# Altium schematic sheet DDR4_Arria10.SchDoc: DDR4
size B; DocumentNumber: 19; SheetNumber: 19; SheetTotal: 46
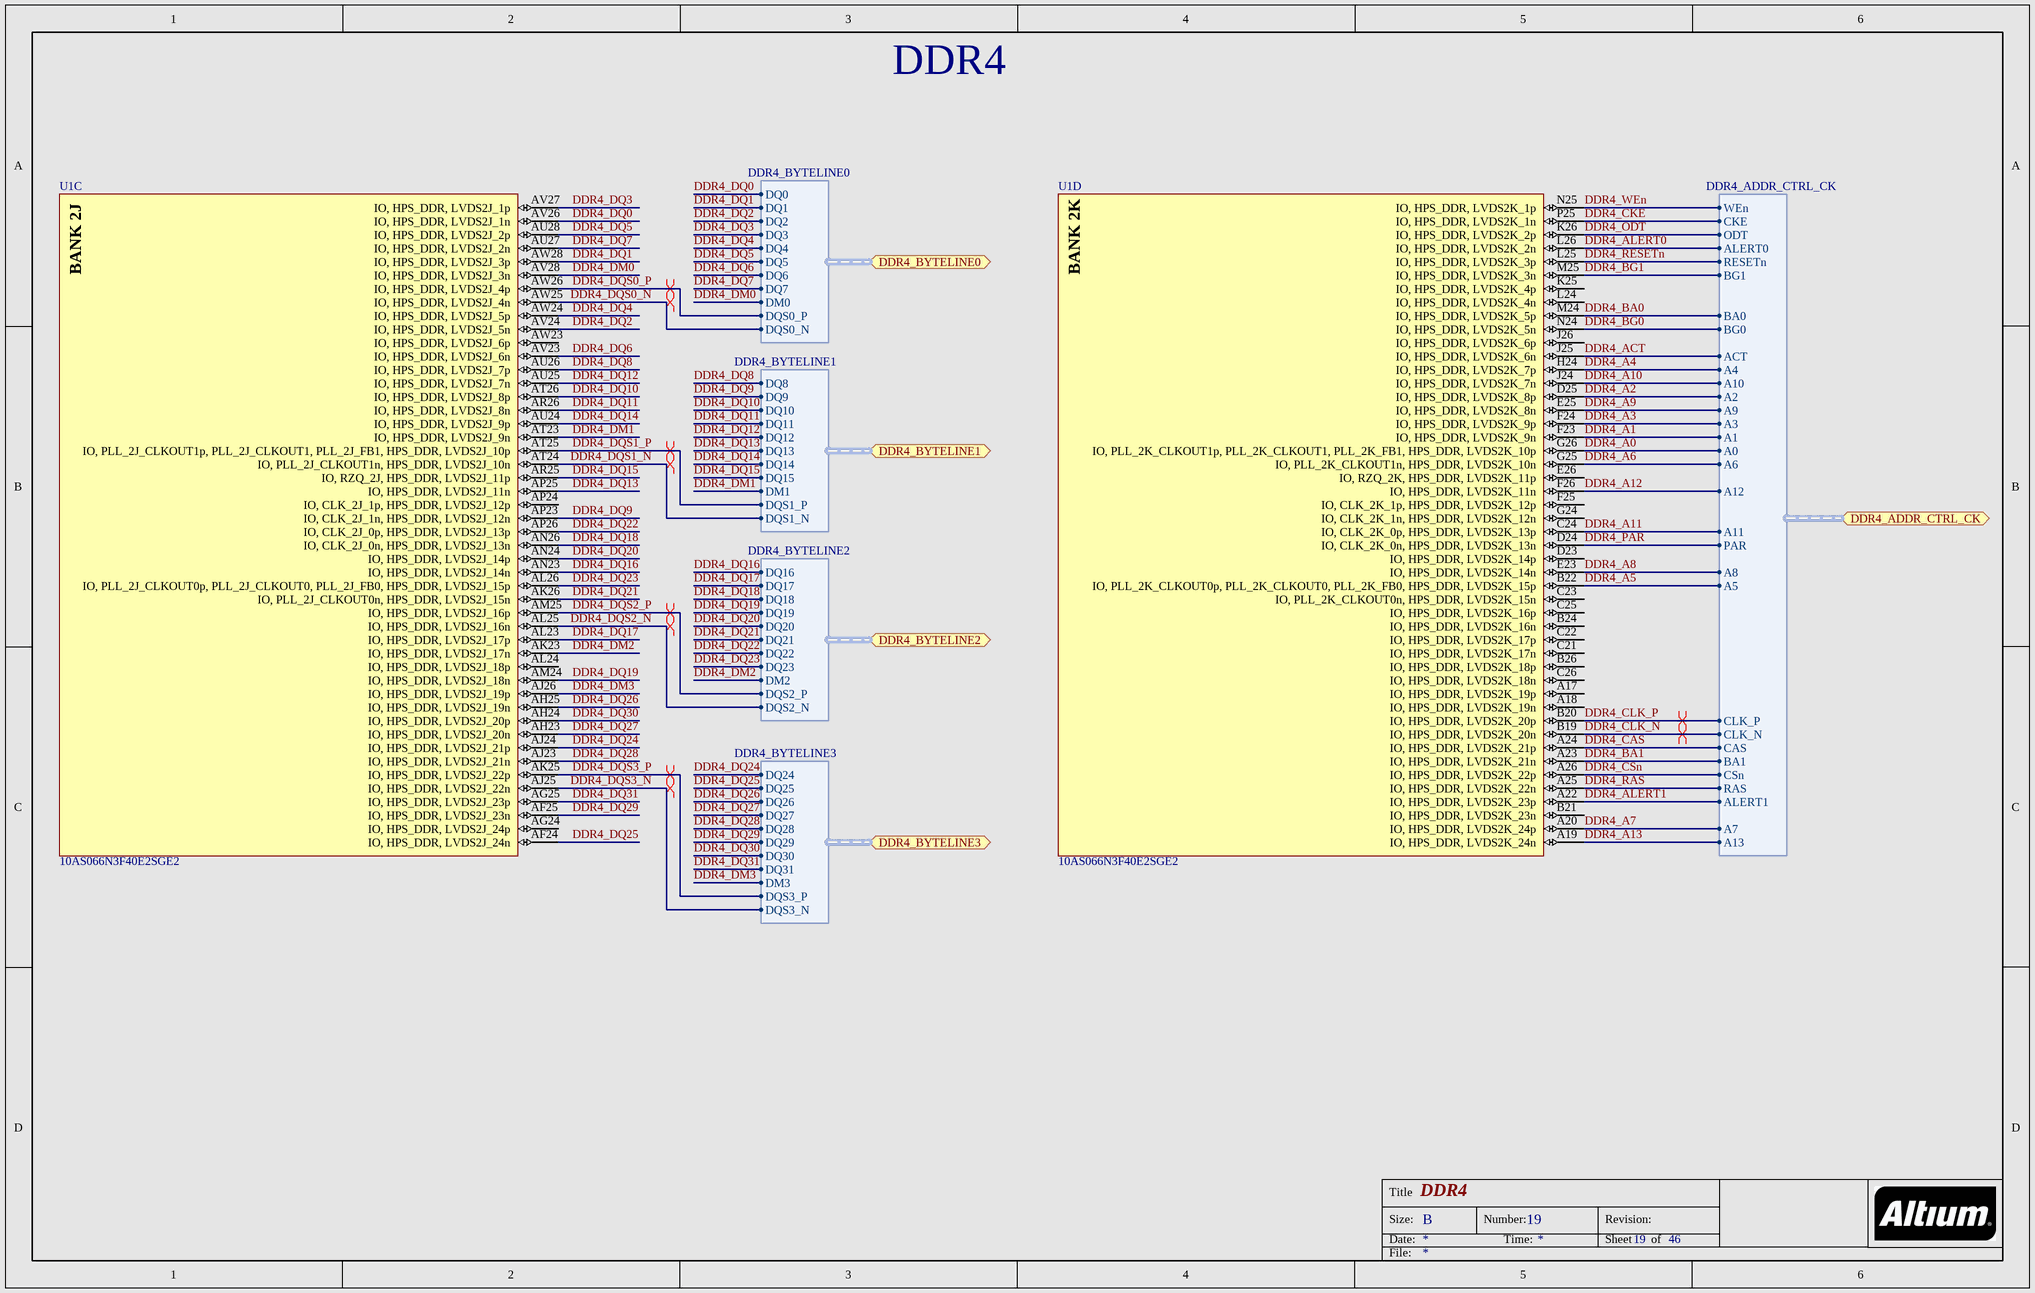
[diagram p0: DDR4_Arria10.SchDoc]

## Parts
U1  10AS066N3F40E2SGE2  [ALTR-FBGA1517_A-350]  (parts C,D of 31)

## Ports
DDR4_ADDR_CTRL_CK (harness DDR4_ADDR_CTRL_CK), DDR4_BYTELINE0 (harness DDR4_BYTELINE0), DDR4_BYTELINE1 (harness DDR4_BYTELINE1), DDR4_BYTELINE2 (harness DDR4_BYTELINE2), DDR4_BYTELINE3 (harness DDR4_BYTELINE3)

## Harnesses
DDR4_BYTELINE0: DQ0, DQ1, DQ2, DQ3, DQ4, DQ5, DQ6, DQ7, DM0, DQS0_P, DQS0_N
DDR4_BYTELINE1: DQ8, DQ9, DQ10, DQ11, DQ12, DQ13, DQ14, DQ15, DM1, DQS1_P, DQS1_N
DDR4_BYTELINE2: DQ16, DQ17, DQ18, DQ19, DQ20, DQ21, DQ22, DQ23, DM2, DQS2_P, DQS2_N
DDR4_BYTELINE3: DQ24, DQ25, DQ26, DQ27, DQ28, DQ29, DQ30, DQ31, DM3, DQS3_P, DQS3_N
DDR4_ADDR_CTRL_CK: A0, A1, A2, A3, A4, A5, A6, A7, A8, A9, A10, A11, A12, A13, BA0, BA1, BG0, CLK_P, CLK_N, CKE, WEn, CAS, RAS, CSn, PAR, ACT, ODT, ALERT0, RESETn, BG1, ALERT1

## Nets
DDR4_A0: U1.G26(IO,_PLL_2K_CLKOUT1p,_PLL_2K_CLKOUT1,_PLL_2K_FB1,_HPS_DDR,_LVDS2K_10p) ; port DDR4_ADDR_CTRL_CK.A0
DDR4_A1: U1.F23(IO,_HPS_DDR,_LVDS2K_9n) ; port DDR4_ADDR_CTRL_CK.A1
DDR4_A2: U1.D25(IO,_HPS_DDR,_LVDS2K_8p) ; port DDR4_ADDR_CTRL_CK.A2
DDR4_A3: U1.F24(IO,_HPS_DDR,_LVDS2K_9p) ; port DDR4_ADDR_CTRL_CK.A3
DDR4_A4: U1.H24(IO,_HPS_DDR,_LVDS2K_7p) ; port DDR4_ADDR_CTRL_CK.A4
DDR4_A5: U1.B22(IO,_PLL_2K_CLKOUT0p,_PLL_2K_CLKOUT0,_PLL_2K_FB0,_HPS_DDR,_LVDS2K_15p) ; port DDR4_ADDR_CTRL_CK.A5
DDR4_A6: U1.G25(IO,_PLL_2K_CLKOUT1n,_HPS_DDR,_LVDS2K_10n) ; port DDR4_ADDR_CTRL_CK.A6
DDR4_A7: U1.A20(IO,_HPS_DDR,_LVDS2K_24p) ; port DDR4_ADDR_CTRL_CK.A7
DDR4_A8: U1.E23(IO,_HPS_DDR,_LVDS2K_14n) ; port DDR4_ADDR_CTRL_CK.A8
DDR4_A9: U1.E25(IO,_HPS_DDR,_LVDS2K_8n) ; port DDR4_ADDR_CTRL_CK.A9
DDR4_A10: U1.J24(IO,_HPS_DDR,_LVDS2K_7n) ; port DDR4_ADDR_CTRL_CK.A10
DDR4_A11: U1.C24(IO,_CLK_2K_0p,_HPS_DDR,_LVDS2K_13p) ; port DDR4_ADDR_CTRL_CK.A11
DDR4_A12: U1.F26(IO,_HPS_DDR,_LVDS2K_11n) ; port DDR4_ADDR_CTRL_CK.A12
DDR4_A13: U1.A19(IO,_HPS_DDR,_LVDS2K_24n) ; port DDR4_ADDR_CTRL_CK.A13
DDR4_ACT: U1.J25(IO,_HPS_DDR,_LVDS2K_6n) ; port DDR4_ADDR_CTRL_CK.ACT
DDR4_ALERT0: U1.L26(IO,_HPS_DDR,_LVDS2K_2n) ; port DDR4_ADDR_CTRL_CK.ALERT0
DDR4_ALERT1: U1.A22(IO,_HPS_DDR,_LVDS2K_23p) ; port DDR4_ADDR_CTRL_CK.ALERT1
DDR4_BA0: U1.M24(IO,_HPS_DDR,_LVDS2K_5p) ; port DDR4_ADDR_CTRL_CK.BA0
DDR4_BA1: U1.A23(IO,_HPS_DDR,_LVDS2K_21n) ; port DDR4_ADDR_CTRL_CK.BA1
DDR4_BG0: U1.N24(IO,_HPS_DDR,_LVDS2K_5n) ; port DDR4_ADDR_CTRL_CK.BG0
DDR4_BG1: U1.M25(IO,_HPS_DDR,_LVDS2K_3n) ; port DDR4_ADDR_CTRL_CK.BG1
DDR4_CAS: U1.A24(IO,_HPS_DDR,_LVDS2K_21p) ; port DDR4_ADDR_CTRL_CK.CAS
DDR4_CKE: U1.P25(IO,_HPS_DDR,_LVDS2K_1n) ; port DDR4_ADDR_CTRL_CK.CKE
DDR4_CLK_N: U1.B19(IO,_HPS_DDR,_LVDS2K_20n) ; port DDR4_ADDR_CTRL_CK.CLK_N
DDR4_CLK_P: U1.B20(IO,_HPS_DDR,_LVDS2K_20p) ; port DDR4_ADDR_CTRL_CK.CLK_P
DDR4_CSn: U1.A26(IO,_HPS_DDR,_LVDS2K_22p) ; port DDR4_ADDR_CTRL_CK.CSn
DDR4_DM0: U1.AV28(IO,_HPS_DDR,_LVDS2J_3n) ; port DDR4_BYTELINE0.DM0
DDR4_DM1: U1.AT23(IO,_HPS_DDR,_LVDS2J_9n) ; port DDR4_BYTELINE1.DM1
DDR4_DM2: U1.AK23(IO,_HPS_DDR,_LVDS2J_17n) ; port DDR4_BYTELINE2.DM2
DDR4_DM3: U1.AJ26(IO,_HPS_DDR,_LVDS2J_19p) ; port DDR4_BYTELINE3.DM3
DDR4_DQ0: U1.AV26(IO,_HPS_DDR,_LVDS2J_1n) ; port DDR4_BYTELINE0.DQ0
DDR4_DQ1: U1.AW28(IO,_HPS_DDR,_LVDS2J_3p) ; port DDR4_BYTELINE0.DQ1
DDR4_DQ2: U1.AV24(IO,_HPS_DDR,_LVDS2J_5n) ; port DDR4_BYTELINE0.DQ2
DDR4_DQ3: U1.AV27(IO,_HPS_DDR,_LVDS2J_1p) ; port DDR4_BYTELINE0.DQ3
DDR4_DQ4: U1.AW24(IO,_HPS_DDR,_LVDS2J_5p) ; port DDR4_BYTELINE0.DQ4
DDR4_DQ5: U1.AU28(IO,_HPS_DDR,_LVDS2J_2p) ; port DDR4_BYTELINE0.DQ5
DDR4_DQ6: U1.AV23(IO,_HPS_DDR,_LVDS2J_6n) ; port DDR4_BYTELINE0.DQ6
DDR4_DQ7: U1.AU27(IO,_HPS_DDR,_LVDS2J_2n) ; port DDR4_BYTELINE0.DQ7
DDR4_DQ8: U1.AU26(IO,_HPS_DDR,_LVDS2J_7p) ; port DDR4_BYTELINE1.DQ8
DDR4_DQ9: U1.AP23(IO,_CLK_2J_1n,_HPS_DDR,_LVDS2J_12n) ; port DDR4_BYTELINE1.DQ9
DDR4_DQ10: U1.AT26(IO,_HPS_DDR,_LVDS2J_8p) ; port DDR4_BYTELINE1.DQ10
DDR4_DQ11: U1.AR26(IO,_HPS_DDR,_LVDS2J_8n) ; port DDR4_BYTELINE1.DQ11
DDR4_DQ12: U1.AU25(IO,_HPS_DDR,_LVDS2J_7n) ; port DDR4_BYTELINE1.DQ12
DDR4_DQ13: U1.AP25(IO,_HPS_DDR,_LVDS2J_11n) ; port DDR4_BYTELINE1.DQ13
DDR4_DQ14: U1.AU24(IO,_HPS_DDR,_LVDS2J_9p) ; port DDR4_BYTELINE1.DQ14
DDR4_DQ15: U1.AR25(IO,_RZQ_2J,_HPS_DDR,_LVDS2J_11p) ; port DDR4_BYTELINE1.DQ15
DDR4_DQ16: U1.AN23(IO,_HPS_DDR,_LVDS2J_14n) ; port DDR4_BYTELINE2.DQ16
DDR4_DQ17: U1.AL23(IO,_HPS_DDR,_LVDS2J_17p) ; port DDR4_BYTELINE2.DQ17
DDR4_DQ18: U1.AN26(IO,_CLK_2J_0n,_HPS_DDR,_LVDS2J_13n) ; port DDR4_BYTELINE2.DQ18
DDR4_DQ19: U1.AM24(IO,_HPS_DDR,_LVDS2J_18n) ; port DDR4_BYTELINE2.DQ19
DDR4_DQ20: U1.AN24(IO,_HPS_DDR,_LVDS2J_14p) ; port DDR4_BYTELINE2.DQ20
DDR4_DQ21: U1.AK26(IO,_PLL_2J_CLKOUT0n,_HPS_DDR,_LVDS2J_15n) ; port DDR4_BYTELINE2.DQ21
DDR4_DQ22: U1.AP26(IO,_CLK_2J_0p,_HPS_DDR,_LVDS2J_13p) ; port DDR4_BYTELINE2.DQ22
DDR4_DQ23: U1.AL26(IO,_PLL_2J_CLKOUT0p,_PLL_2J_CLKOUT0,_PLL_2J_FB0,_HPS_DDR,_LVDS2J_15p) ; port DDR4_BYTELINE2.DQ23
DDR4_DQ24: U1.AJ24(IO,_HPS_DDR,_LVDS2J_21p) ; port DDR4_BYTELINE3.DQ24
DDR4_DQ25: U1.AF24(IO,_HPS_DDR,_LVDS2J_24n) ; port DDR4_BYTELINE3.DQ25
DDR4_DQ26: U1.AH25(IO,_HPS_DDR,_LVDS2J_19n) ; port DDR4_BYTELINE3.DQ26
DDR4_DQ27: U1.AH23(IO,_HPS_DDR,_LVDS2J_20n) ; port DDR4_BYTELINE3.DQ27
DDR4_DQ28: U1.AJ23(IO,_HPS_DDR,_LVDS2J_21n) ; port DDR4_BYTELINE3.DQ28
DDR4_DQ29: U1.AF25(IO,_HPS_DDR,_LVDS2J_23n) ; port DDR4_BYTELINE3.DQ29
DDR4_DQ30: U1.AH24(IO,_HPS_DDR,_LVDS2J_20p) ; port DDR4_BYTELINE3.DQ30
DDR4_DQ31: U1.AG25(IO,_HPS_DDR,_LVDS2J_23p) ; port DDR4_BYTELINE3.DQ31
DDR4_DQS0_N: U1.AW25(IO,_HPS_DDR,_LVDS2J_4n) ; port DDR4_BYTELINE0.DQS0_N
DDR4_DQS0_P: U1.AW26(IO,_HPS_DDR,_LVDS2J_4p) ; port DDR4_BYTELINE0.DQS0_P
DDR4_DQS1_N: U1.AT24(IO,_PLL_2J_CLKOUT1n,_HPS_DDR,_LVDS2J_10n) ; port DDR4_BYTELINE1.DQS1_N
DDR4_DQS1_P: U1.AT25(IO,_PLL_2J_CLKOUT1p,_PLL_2J_CLKOUT1,_PLL_2J_FB1,_HPS_DDR,_LVDS2J_10p) ; port DDR4_BYTELINE1.DQS1_P
DDR4_DQS2_N: U1.AL25(IO,_HPS_DDR,_LVDS2J_16n) ; port DDR4_BYTELINE2.DQS2_N
DDR4_DQS2_P: U1.AM25(IO,_HPS_DDR,_LVDS2J_16p) ; port DDR4_BYTELINE2.DQS2_P
DDR4_DQS3_N: U1.AJ25(IO,_HPS_DDR,_LVDS2J_22n) ; port DDR4_BYTELINE3.DQS3_N
DDR4_DQS3_P: U1.AK25(IO,_HPS_DDR,_LVDS2J_22p) ; port DDR4_BYTELINE3.DQS3_P
DDR4_ODT: U1.K26(IO,_HPS_DDR,_LVDS2K_2p) ; port DDR4_ADDR_CTRL_CK.ODT
DDR4_PAR: U1.D24(IO,_CLK_2K_0n,_HPS_DDR,_LVDS2K_13n) ; port DDR4_ADDR_CTRL_CK.PAR
DDR4_RAS: U1.A25(IO,_HPS_DDR,_LVDS2K_22n) ; port DDR4_ADDR_CTRL_CK.RAS
DDR4_RESETn: U1.L25(IO,_HPS_DDR,_LVDS2K_3p) ; port DDR4_ADDR_CTRL_CK.RESETn
DDR4_WEn: U1.N25(IO,_HPS_DDR,_LVDS2K_1p) ; port DDR4_ADDR_CTRL_CK.WEn

Not connected (* = marked no-connect by the designer): U1 A17(IO,_HPS_DDR,_LVDS2K_19p) A18(IO,_HPS_DDR,_LVDS2K_19n) AG24(IO,_HPS_DDR,_LVDS2J_24p) AL24(IO,_HPS_DDR,_LVDS2J_18p) AP24(IO,_CLK_2J_1p,_HPS_DDR,_LVDS2J_12p) AW23(IO,_HPS_DDR,_LVDS2J_6p) B21(IO,_HPS_DDR,_LVDS2K_23n) B24(IO,_HPS_DDR,_LVDS2K_16n) B26(IO,_HPS_DDR,_LVDS2K_18p) C21(IO,_HPS_DDR,_LVDS2K_17n) C22(IO,_HPS_DDR,_LVDS2K_17p) C23(IO,_PLL_2K_CLKOUT0n,_HPS_DDR,_LVDS2K_15n) C25(IO,_HPS_DDR,_LVDS2K_16p) C26(IO,_HPS_DDR,_LVDS2K_18n) D23(IO,_HPS_DDR,_LVDS2K_14p) E26(IO,_RZQ_2K,_HPS_DDR,_LVDS2K_11p) F25(IO,_CLK_2K_1p,_HPS_DDR,_LVDS2K_12p) G24(IO,_CLK_2K_1n,_HPS_DDR,_LVDS2K_12n) J26(IO,_HPS_DDR,_LVDS2K_6p) K25(IO,_HPS_DDR,_LVDS2K_4p) L24(IO,_HPS_DDR,_LVDS2K_4n)

## Layout directives
differential pair: DDR4_CLK_N, DDR4_CLK_P, DDR4_DQS0_N, DDR4_DQS0_P, DDR4_DQS1_N, DDR4_DQS1_P, DDR4_DQS2_N, DDR4_DQS2_P, DDR4_DQS3_N, DDR4_DQS3_P

## Notes on the sheet
- Title
- Size:
- Date:
- B
- Number:
- Time:
- Revision:
- Sheet
- of
- File:
- (in symbol CMP-1689-00006-3, part C) BANK 2J
- (in symbol CMP-1689-00006-3, part D) BANK 2K

## Library data of the parts
U1 = CMP-1689-00006-3: Arria 10 SX Family, 588 I/O Pins, 16 Fractional PLLs, 1517-Pin FBGA, Speed Grade 2, Extended Grade, RoHS; ComponentLink3Description: Package Specification; PackageVersion: Rev. 5.0, 01/2016; ComponentLink3URL: https://www.altera.com/content/dam/altera-www/global/en_US/pdfs/literature/packaging/04r00461-04.pdf; ComponentLink2Description: Datasheet; Code_JEDEC: MS-034; Mounting Technology: Surface Mount; PartNumber: 10AS066N3F40E2SGE2; PackageDescription: 1517-Pin FineLine Ball-Grid Array (FBGA), Body 40 x 40 mm, Pitch 1 mm; ComponentLink2URL: https://www.altera.com/content/dam/altera-www/global/en_US/pdfs/literature/hb/arria-10/a10_datasheet.pdf; ComponentLink1URL: https://www.altera.com/; DatasheetVersion: Rev. 2016-06-24, 06/2016; ComponentLink1Description: Manufacturer URL